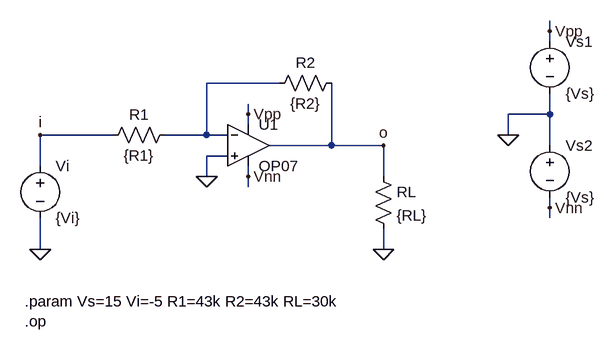
[diagram p0: schematic Q1.asc]
Q1.asc, the LTspice schematic file:
Version 4.1
SHEET 1 880 680
WIRE 704 -96 704 -112
WIRE 704 -80 704 -96
WIRE 288 -16 176 -16
WIRE 240 32 240 16
WIRE 704 32 704 0
WIRE 704 32 640 32
WIRE 240 48 240 32
WIRE 32 64 -80 64
WIRE 176 64 176 -16
WIRE 176 64 112 64
WIRE 208 64 176 64
WIRE 640 64 640 32
WIRE 368 80 368 -16
WIRE 368 80 272 80
WIRE 448 80 368 80
WIRE 704 80 704 32
WIRE 208 96 176 96
WIRE -80 112 -80 64
WIRE 176 128 176 96
WIRE 240 128 240 112
WIRE 448 128 448 80
WIRE 240 144 240 128
WIRE 704 176 704 160
WIRE 704 192 704 176
WIRE -80 240 -80 192
WIRE 448 240 448 208
FLAG 176 128 0
FLAG 240 32 Vpp
FLAG 240 128 Vnn
FLAG -80 240 0
FLAG -80 64 i
FLAG 448 240 0
FLAG 640 64 0
FLAG 704 -96 Vpp
FLAG 704 176 Vnn
FLAG 448 80 o
SYMBOL OpAmps\\OP07 240 16 R0
SYMATTR InstName U1
SYMBOL res 384 -32 R90
WINDOW 0 0 56 VBottom 2
WINDOW 3 32 56 VTop 2
SYMATTR InstName R2
SYMATTR Value {R2}
SYMBOL res 432 112 R0
SYMATTR InstName RL
SYMATTR Value {RL}
SYMBOL res 128 48 R90
WINDOW 0 0 56 VBottom 2
WINDOW 3 32 56 VTop 2
SYMATTR InstName R1
SYMATTR Value {R1}
SYMBOL voltage -80 96 R0
SYMATTR InstName Vi
SYMATTR Value {Vi}
SYMBOL voltage 704 -96 R0
SYMATTR InstName Vs1
SYMATTR Value {Vs}
SYMBOL voltage 704 64 R0
SYMATTR InstName Vs2
SYMATTR Value {Vs}
TEXT -104 320 Left 2 !.param Vs=15 Vi=-5 R1=43k R2=43k RL=30k\n.op

The netlist it stands for:
* Q1.asc
X§U1 0 N001 Vpp Vnn o LT1001  ; OP07, pins In+ In- V+ V- OUT
R2 o N001 {R2}
RL o 0 {RL}
R1 N001 i {R1}
Vi i 0 {Vi}
Vs1 Vpp 0 {Vs}
Vs2 0 Vnn {Vs}
.param Vs=15 Vi=-5 R1=43k R2=43k RL=30k
.op
.lib LTC.lib
.backanno
.end